# Altium project ELC102 - Scoreboard.PrjPcb (part 2 of 3)

## Sheet ELC102 - Old Circuits.SchDoc: ELC102 - NEOS Scoreboard
size C
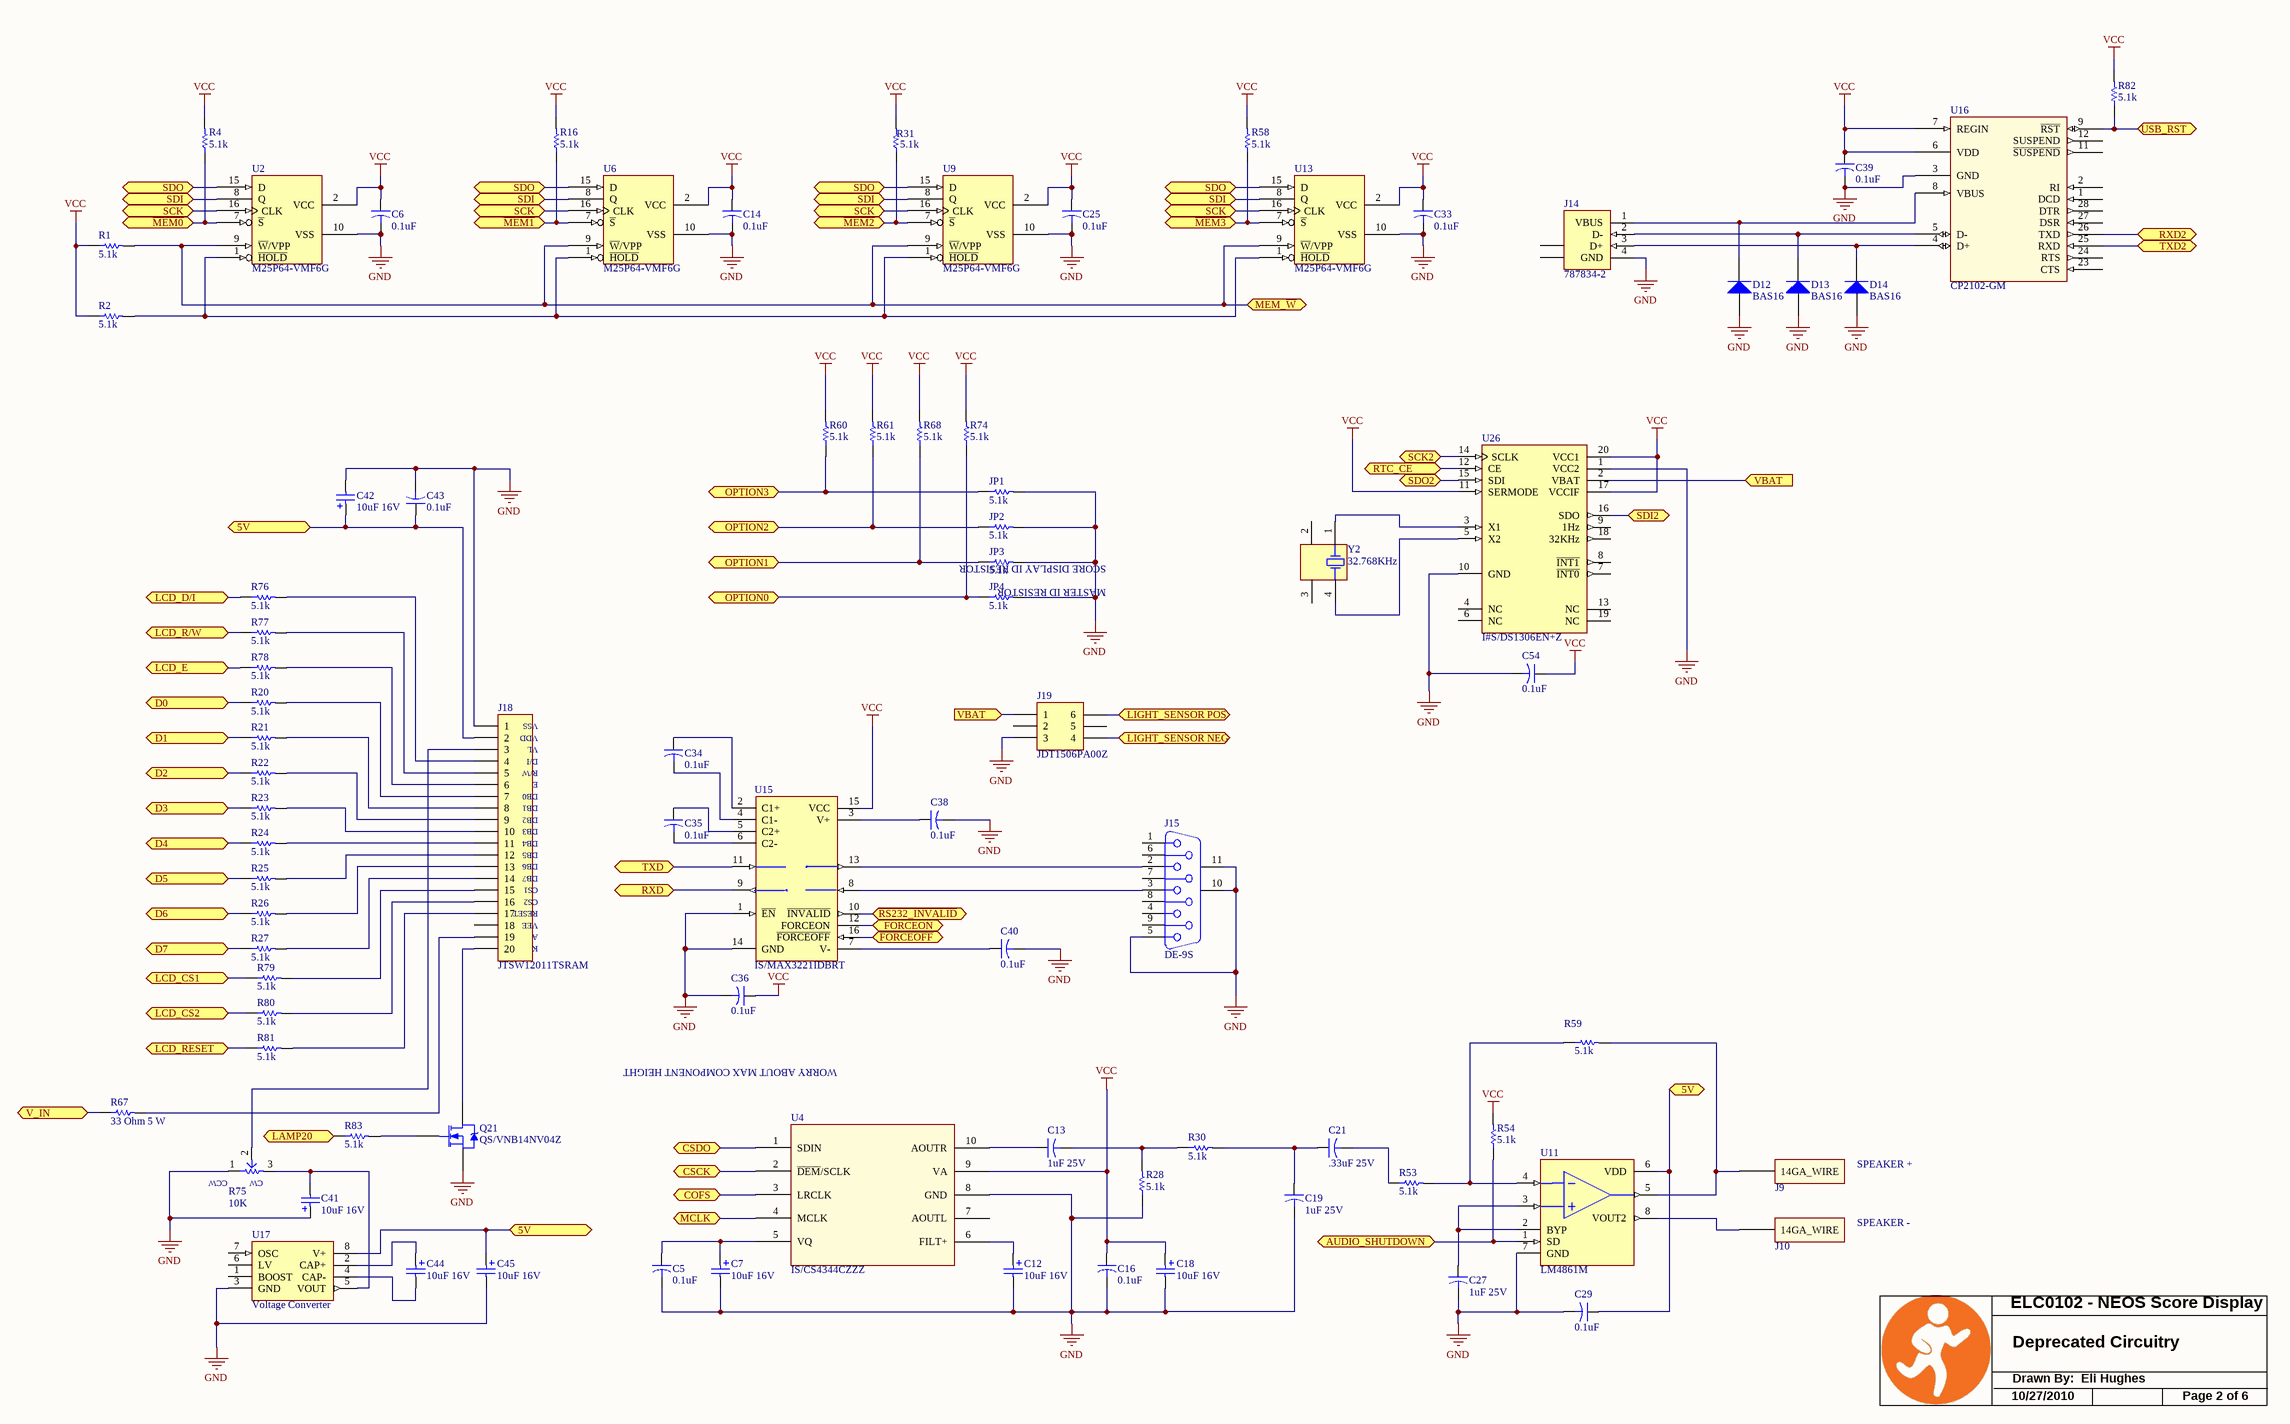
[diagram p3: ELC102 - Old Circuits.SchDoc]

### Parts
C5  0.1uF  [C0805]
C6  0.1uF  [C0805]
C7  10uF 16V  [C4X5.8]
C12  10uF 16V  [C4X5.8]
C13  1uF 25V  [R1206]
C14  0.1uF  [C0805]
C16  0.1uF  [C0805]
C18  10uF 16V  [C4X5.8]
C19  1uF 25V  [R1206]
C21  .33uF 25V  [R1206]
C25  0.1uF  [C0805]
C27  1uF 25V  [R1206]
C29  0.1uF  [C0805]
C33  0.1uF  [C0805]
C34  0.1uF  [C0805]
C35  0.1uF  [C0805]
C36  0.1uF  [C0805]
C38  0.1uF  [C0805]
C39  0.1uF  [C0805]
C40  0.1uF  [C0805]
C41  10uF 16V  [C4X5.8]
C42  10uF 16V  [C4X5.8]
C43  0.1uF  [C0805]
C44  10uF 16V  [C4X5.8]
C45  10uF 16V  [C4X5.8]
C54  0.1uF  [C0805]
D12  BAS16  [SOT23]  (no BOM)
D13  BAS16  [SOT23]  (no BOM)
D14  BAS16  [SOT23]  (no BOM)
J9  ~14GA_WIRE  [WIRE_14GA]  (value not drawn)  (no BOM)
J10  ~14GA_WIRE  [WIRE_14GA]  (value not drawn)  (no BOM)
J14  787834-2  [KUSBVX-BS1N]  (no BOM)
J15  DE-9S  [DSUBV9]  (no BOM)
J18  JTSW12011TSRAM  [JTSW12011TSRAM]
J19  JDT1506PA00Z  [JDT1506PA00Z - 2 holes]
JP1  5.1k  [R0805]
JP2  5.1k  [R0805]
JP3  5.1k  [R0805]
JP4  5.1k  [R0805]
Q21  QS/VNB14NV04Z  [D2PAK]
R1  5.1k  [R0805]
R2  5.1k  [R0805]
R4  5.1k  [R0805]
R16  5.1k  [R0805]
R20  5.1k  [R0805]
R21  5.1k  [R0805]
R22  5.1k  [R0805]
R23  5.1k  [R0805]
R24  5.1k  [R0805]
R25  5.1k  [R0805]
R26  5.1k  [R0805]
R27  5.1k  [R0805]
R28  5.1k  [R0805]
R30  5.1k  [R0805]
R31  5.1k  [R0805]
R53  5.1k  [R0805]
R54  5.1k  [R0805]
R58  5.1k  [R0805]
R59  5.1k  [R0805]
R60  5.1k  [R0805]
R61  5.1k  [R0805]
R67  33 Ohm 5 W  [RES30.6-25.5X9]
R68  5.1k  [R0805]
R74  5.1k  [R0805]
R75  10K  [P3299W]
R76  5.1k  [R0805]
R77  5.1k  [R0805]
R78  5.1k  [R0805]
R79  5.1k  [R0805]
R80  5.1k  [R0805]
R81  5.1k  [R0805]
R82  5.1k  [R0805]
R83  5.1k  [R0805]
U2  M25P64-VMF6G  [so16w]  (no BOM)
U4  IS/CS4344CZZZ  [TSSOP\10]
U6  M25P64-VMF6G  [so16w]  (no BOM)
U9  M25P64-VMF6G  [so16w]  (no BOM)
U11  LM4861M  [soic 8]
U13  M25P64-VMF6G  [so16w]  (no BOM)
U15  IS/MAX3221IDBRT  [SSOP16]  (no BOM)
U16  CP2102-GM  [QFN28]  (no BOM)
U17  Voltage Converter  [SOIC 8]
U26  I#S/DS1306EN+Z  [TSSOP-20]
Y2  32.768KHz  [ZS/MC306]

### Ports
5V, AUDIO_SHUTDOWN, COFS, CSCK, CSDO, D0, D1, D2, D3, D4, D5, D6, D7, FORCEON, LAMP20, LCD_CS1, LCD_CS2, LCD_D/I, LCD_E, LCD_R/W, LCD_RESET, LIGHT_SENSOR NEG, LIGHT_SENSOR POS, MCLK, MEM_~{W}, OPTION0, OPTION1, OPTION2, OPTION3, RTC_CE, RXD, RXD2, SCK, SCK2, SDI, SDI2, SDO, SDO2, TXD, TXD2, USB_RST, V_IN, VBAT (in), ~{FORCEOFF}, ~{MEM0}, ~{MEM1}, ~{MEM2}, ~{MEM3}, ~{RS232_INVALID}

### Nets
+5 VDC: C29.1 C42.1 C43.1 C45.1 J18.2 U11.6(VDD) U17.8(V+) ; port 5V
GND: C5.2 C6.2 C7.2 C12.2 C14.2 C16.2 C18.2 C19.2 C25.2 C27.2 C29.2 C33.2 C36.2 C38.2 C39.2 C40.2 C41.1 C42.2 C43.2 C45.2 C54.2 D12.1(A) D13.1(A) D14.1(A) J14.4(GND) J15.5 J15.10(MH1) J15.11(MH2) J18.1 J19.3 JP1.2 JP2.2 JP3.2 JP4.2 Q21.3(S) R28.1 R75.1(CCW) U2.10(VSS) U4.8(GND) U6.10(VSS) U9.10(VSS) U11.7(GND) U13.10(VSS) U15.1(~{EN}) U15.14(GND) U16.3(GND) U17.3(GND) U26.1(VCC2) U26.10(GND)
VCC: C6.1 C14.1 C16.1 C18.1 C25.1 C33.1 C36.1 C39.1 C54.1 R1.1 R2.1 R4.2 R16.2 R31.2 R54.2 R58.2 R60.2 R61.2 R68.2 R74.2 R82.2 U2.2(VCC) U4.9(VA) U6.2(VCC) U9.2(VCC) U13.2(VCC) U15.15(VCC) U16.6(VDD) U16.7(REGIN) U26.11(SERMODE) U26.17(VCCIF) U26.20(VCC1)  [project net +3.3 VDC]
Vin: R67.1 ; port V_IN
AUDIO_SHUTDOWN: R54.1 U11.1(SD) ; port AUDIO_SHUTDOWN
COFS: U4.3(LRCLK) ; port COFS
CSCK: U4.2(~{DEM}/SCLK) ; port CSCK
CSDO: U4.1(SDIN) ; port CSDO
D0: R20.1 ; port D0
D1: R21.1 ; port D1
D2: R22.1 ; port D2
D3: R23.1 ; port D3
D4: R24.1 ; port D4
D5: R25.1 ; port D5
D6: R26.1 ; port D6
D7: R27.1 ; port D7
~{FORCEOFF}: U15.16(~{FORCEOFF}) ; port ~{FORCEOFF}
FORCEON: U15.12(FORCEON) ; port FORCEON
LAMP20: R83.1 ; port LAMP20
LCD_CS1: R79.1 ; port LCD_CS1
LCD_CS2: R80.1 ; port LCD_CS2
LCD_D/I: R76.1 ; port LCD_D/I
LCD_E: R78.1 ; port LCD_E
LCD_R/W: R77.1 ; port LCD_R/W
LCD_RESET: R81.1 ; port LCD_RESET
LIGHT_SENSOR NEG: J19.4 ; port LIGHT_SENSOR NEG
LIGHT_SENSOR POS: J19.6 ; port LIGHT_SENSOR POS
MCLK: U4.4(MCLK) ; port MCLK
MEM0: R4.1 U2.7(~{S}) ; port ~{MEM0}
MEM1: R16.1 U6.7(~{S}) ; port ~{MEM1}
MEM2: R31.1 U9.7(~{S}) ; port ~{MEM2}
MEM3: R58.1 U13.7(~{S}) ; port ~{MEM3}
MEM_SCK: U2.16(CLK) U6.16(CLK) U9.16(CLK) U13.16(CLK) ; port SCK
MEM_SDI: U2.8(Q) U6.8(Q) U9.8(Q) U13.8(Q) ; port SDI
MEM_SDO: U2.15(D) U6.15(D) U9.15(D) U13.15(D) ; port SDO
MEM_~{W}: R1.2 U2.9(~{W}/VPP) U6.9(~{W}/VPP) U9.9(~{W}/VPP) U13.9(~{W}/VPP) ; port MEM_~{W}
OPT0: JP4.1 R74.1 ; port OPTION0
OPT1: JP3.1 R68.1 ; port OPTION1
OPT2: JP2.1 R61.1 ; port OPTION2
OPT3: JP1.1 R60.1 ; port OPTION3
~{RS232_INVALID}: U15.10(~{INVALID}) ; port ~{RS232_INVALID}
RTC_CE: U26.12(CE) ; port RTC_CE
RTC_SCK: U26.14(SCLK) ; port SCK2
RTC_SDI: U26.16(SDO) ; port SDI2
RTC_SDO: U26.15(SDI) ; port SDO2
RXD_RS232: U15.9(R1OUT) ; port RXD
RXD_USB: U16.26(TXD) ; port RXD2
TXD_RS233: U15.11(T1IN) ; port TXD
TXD_USB: U16.25(RXD) ; port TXD2
USB_RST: R82.1 U16.9(~{RST}) ; port USB_RST
VBAT: J19.1 U26.2(VBAT) ; port VBAT
NetC5_1: C5.1 C7.1 U4.5(VQ)
NetC12_1: C12.1 U4.6(FILT+)
NetC13_1: C13.1 U4.10(AOUTR)
NetC13_2: C13.2 R28.2 R30.1
NetC19_1: C19.1 C21.1 R30.2
NetC21_2: C21.2 R53.1
NetC27_1: C27.1 U11.2(BYP) U11.3(IN+)
NetC34_1: C34.1 U15.2(C1+)
NetC34_2: C34.2 U15.4(C1-)
NetC35_1: C35.1 U15.5(C2+)
NetC35_2: C35.2 U15.6(C2-)
NetC38_1: C38.1 U15.3(V+)
NetC40_1: C40.1 U15.7(V-)
NetC41_2: C41.2 R75.3(CW) U17.5(VOUT)
NetC44_1: C44.1 U17.2(CAP+)
NetC44_2: C44.2 U17.4(CAP-)
NetD12_3: D12.3(K) J14.1(VBUS) U16.8(VBUS)
NetD13_3: D13.3(K) J14.2(D-) U16.5(D-)
NetD14_3: D14.3(K) J14.3(D+) U16.4(D+)
NetJ9_1: J9.1(14GA_WIRE) R59.2 U11.5(VOUT1)
NetJ10_1: J10.1(14GA_WIRE) U11.8(VOUT2)
NetJ15_2: J15.2 U15.13(T1OUT)
NetJ15_3: J15.3 U15.8(R1IN)
NetJ18_3: J18.3 R75.2(T)
NetJ18_4: J18.4 R76.2
NetJ18_5: J18.5 R77.2
NetJ18_6: J18.6 R78.2
NetJ18_7: J18.7 R20.2
NetJ18_8: J18.8 R21.2
NetJ18_9: J18.9 R22.2
NetJ18_10: J18.10 R23.2
NetJ18_11: J18.11 R24.2
NetJ18_12: J18.12 R25.2
NetJ18_13: J18.13 R26.2
NetJ18_14: J18.14 R27.2
NetJ18_15: J18.15 R79.2
NetJ18_16: J18.16 R80.2
NetJ18_17: J18.17 R81.2
NetJ18_19: J18.19 R67.2
NetJ18_20: J18.20 Q21.2(D)
NetQ21_1: Q21.1(G) R83.2
NetR2_2: R2.2 U2.1(~{HOLD}) U6.1(~{HOLD}) U9.1(~{HOLD}) U13.1(~{HOLD})
NetR53_2: R53.2 R59.1 U11.4(IN-)
NetU26_3: U26.3(X1) Y2.1(OSC1)
NetU26_5: U26.5(X2) Y2.4(OSC2)

Not connected (* = marked no-connect by the designer): J14 5(SHLD) 6(SHLD); J15 1 4 6 7 8 9; J18 18; J19 2 5; U4 7(AOUTL); U16 1(DCD) 2(RI) 11(~{SUSPEND}) 12(SUSPEND) 23(CTS) 24(RTS) 27(DSR) 28(DTR); U17 1(BOOST) 6(LV) 7(OSC); U26 4(NC) 6(NC) 7(~{INT0}) 8(~{INT1}) 9(1Hz) 13(NC) 18(32KHz) 19(NC); Y2 2(COM) 3(COM)

### Notes on the sheet
- MASTER ID RESISTOR
- SCORE DISPLAY ID RESISTOR
- (near J18) VSS
- (near J18) VDD
- (near J18) VL
- (near J18) R/W
- (near J18) D/I
- (near J18) E
- (near J18) DB0
- (near J18) DB1
- (near J18) DB2
- (near J18) DB3
- (near J18) DB4
- (near J18) DB5
- (near J18) DB6
- (near J18) DB7
- (near J18) CS1
- (near J18) CS2
- (near J18) RESET
- (near J18) VEE
- (near J18) A
- (near J18) K
- WORRY ABOUT MAX COMPONENT HEIGHT
- SPEAKER +
- SPEAKER -
- ELC0102 - NEOS Score Display
- Deprecated Circuitry
- 10/27/2010
- Drawn By:  Eli Hughes
- Page 2 of 6

### Library data of the parts
C5 C6 C14 C16 C25 C29 C33-C36 C38-C40 C43 C54 = CS/C0805C104K5RACK: CAP .10UF 50V CERAMIC X7R 0805; Manufacturer: Kemet; Manufacturer Part Number: C0805C104K5RACTU; Source Part Number: 399-1170-2-ND; Capacitance: 0.1µF; Tolerance: ±10%; ROHS Certificate: Lead free / RoHS compliant; Source: Digikey; Value: 0.1uF; Supplier 1: Digi-Key; RoHS: RoHS Compliant; Category: Capacitors; Stock 1: 10120790; Pricing 1: 10=0.105, 100=0.0378, 250=0.02732, 500=0.02016, 1000=0.01365 (USD); Voltage - Rated: 50V; Temperature Coefficient: X7R; Mounting Type: Surface Mount, MLCC; Operating Temperature: -55°C ~ 125°C; Features: -; Applications: General Purpose; Ratings: -; Package / Case: 0805 (2012 Metric); Size / Dimension: 0.079" L x 0.049" W (2.00mm x 1.25mm); Lead Spacing: -; Thickness: 0.90mm; Packaging: Cut Tape (CT); Lead Style: -; ComponentLink1URL: http://www.kemet.com/datasheets&C0805C104K5RACTU; ComponentLink1Description: http://www.kemet.com/datasheets&C0805C104K5RACTU; Supplier Part Number 1: 399-1170-1-ND
C7 C12 C18 C41 C42 C44 C45 = CS/EEVFK1C100RP: Panasonic 10uF 16V SMT; Manufacturer: Panasonic - ECG; Manufacturer Part Number: EEE-FK1C100R; Source Part Number: PCE3782TR-ND; Value: EEE-FK1C100R; Description: CAP ELECT 10UF 16V FK SMD; Capacitance: 10µF; Tolerance: ±20%; Lifetime @ Temp.: 2000 Hrs @ 105°C; Ripple Current: 90mA; Impedance: 1.35 Ohm; Surface Mount Land Size: 0.169" L x 0.169" W (4.30mm x 4.30mm); ROHS Certificate: Lead free / RoHS compliant; Source: Digikey; Supplier 1: Digi-Key; RoHS: RoHS Compliant; Category: Capacitors; Stock 1: 412703; Pricing 1: 1=0.54, 50=0.309, 100=0.2575, 250=0.19312, 500=0.1648, 1000=0.12875 (USD); Voltage Rating: 16V; Operating Temperature: -55°C ~ 105°C; Features: General Purpose; ESR (Equivalent Series Resistance): -; Mounting Type: Surface Mount; Package / Case: Radial, Can - SMD; Size / Dimension: 0.157" Dia (4.00mm); Height: 0.228" (5.80mm); Lead Spacing: -; Packaging: Cut Tape (CT); ComponentLink1URL: http://industrial.panasonic.com/www-cgi/jvcr13pz.cgi?E+PZ+3+ABA0120+EEEFK1C100R+7+WW; ComponentLink1Description: http://industrial.panasonic.com/www-cgi/jvcr13pz.cgi?E+PZ+3+ABA0120+EEEFK1C100R+7+WW; Supplier Part Number 1: PCE3782CT-ND
C13 C19 C27 = CS/ECJ3YB1E105KP: 1uF 25V 1206 Panasonic; Manufacturer: Panasonic - ECG; Manufacturer Part Number: ECJ-3YB1E105K; Description: CAP 1UF 25V CERAMIC X7R 1206; Capacitance: 1.0µF; Tolerance: ±10%; Temperature Coefficient: X7R; Published: 23-Sep-2002; Publisher: Altium Limited; Supplier 1: Digi-Key; RoHS: RoHS Compliant; Category: Capacitors; Stock 1: 0; Voltage - Rated: 25V; Mounting Type: Surface Mount, MLCC; Operating Temperature: -55°C ~ 125°C; Features: Low ESR; Applications: General Purpose; Ratings: -; Package / Case: 1206 (3216 Metric); Size / Dimension: 0.126" L x 0.063" W (3.20mm x 1.60mm); Lead Spacing: -; Thickness: 1.60mm; Packaging: Cut Tape (CT); Lead Style: -; ComponentLink1URL: http://media.digikey.com/pdf/Data%20Sheets/Panasonic%20Capacitors%20PDFs/ECJ(HighCapacitance).pdf; ComponentLink1Description: http://media.digikey.com/pdf/Data%20Sheets/Panasonic%20Capacitors%20PDFs/ECJ(HighCapacitance).pdf; Supplier Part Number 1: PCC1893CT-ND
C21 = CS/ECJ3VB1E334KP: .33uF 25V 1206 Panasonic; Manufacturer: Panasonic - ECG; Manufacturer Part Number: ECJ-3VB1E334K; Description: CAP .33UF 25V CERAMIC X7R 1206; Capacitance: 0.33µF; Tolerance: ±10%; Temperature Coefficient: X7R; Published: 23-Sep-2002; Publisher: Altium Limited; Supplier 1: Digi-Key; RoHS: RoHS Compliant; Category: Capacitors; Stock 1: 0; Voltage - Rated: 25V; Mounting Type: Surface Mount, MLCC; Operating Temperature: -55°C ~ 125°C; Features: Low ESR; Applications: General Purpose; Ratings: -; Package / Case: 1206 (3216 Metric); Size / Dimension: 0.126" L x 0.063" W (3.20mm x 1.60mm); Lead Spacing: -; Thickness: 0.85mm; Packaging: Cut Tape (CT); Lead Style: -; ComponentLink1URL: http://industrial.panasonic.com/www-cgi/jvcr13pz.cgi?E+PZ+3+ABJ0001+ECJ3VB1E334K+7+WW; ComponentLink1Description: http://industrial.panasonic.com/www-cgi/jvcr13pz.cgi?E+PZ+3+ABJ0001+ECJ3VB1E334K+7+WW; Supplier Part Number 1: PCC1889CT-ND
D12-D14 = DS/BAS16000Z: Zetex BAS16 Diode; Manufacturer: Diodes Inc; Manufacturer Part Number: BAS16-7-F; Note: Pin 2 is not connected and not drawn.; Description: DIODE SWITCH 75V 350MW SOT23-3; Voltage - Forward (Vf) (Max) @ If: 1.25V @ 150mA; Voltage - DC Reverse (Vr) (Max): 75V; Current - Average Rectified (Io): 200mA; Current - Reverse Leakage @ Vr: 1µA @ 75V; Diode Type: Standard; Speed: Small Signal =< 200mA (Io), Any Speed; Reverse Recovery Time (trr): 4ns; Capacitance @ Vr, F: 2pF @ 0V, 1MHz; Published: 21-Mar-2003; DatasheetDocument: Oct-1999; PackageDocument: Sep-2001; PackageReference: SOT-23; Publisher: Altium Limited; ComponentLink1Description: Manufacturer Link; ComponentLink1URL: http://www.infineon.com/; Supplier 1: Digi-Key; RoHS: RoHS Compliant; Category: Discrete Semiconductor Products; Stock 1: 856038; Pricing 1: 1=0.3, 10=0.198, 100=0.086, 250=0.05592, 500=0.03956, 1000=0.02795 (USD); Mounting Type: Surface Mount; Package / Case: SOT-23-3, TO-236-3, Micro3™, SSD3, SST3; Packaging: Cut Tape (CT); Supplier Device Package: *; ComponentLink2URL: http://www.diodes.com/datasheets/ds12003.pdf; ComponentLink2Description: http://www.diodes.com/datasheets/ds12003.pdf; Supplier Part Number 1: BAS16-FDICT-ND
J14 = 787834-2: USB 1.1, Vertical, Thru-Hole, B Type, Receptacle, 4 Position, Natural; Manufacturer: Tyco Electronics; Manufacturer Part Number: 5787834-2; ContactMaterial: Copper Alloy; ContactPlating: Gold Flash over Palladium Nickel or Gold (30) over Nickel; TerminationLength: 3.02mm [0.119in.]; PCB_Layout: Complies with manufacturer's recommendation.; DrillSize: Corresponds to nominal value.; PanelGround: Without; Description: CONN RCPT USB TYPE B PCB VERT; Connector Type: USB - B; Number of Contacts: 4; Specifications: USB 2.0; Published: 15-Jul-2004; DatasheetDocument: 11-Jan-2004; PackageDocument: 11-Jan-2004; PackageReference: 787834; Publisher: Altium Limited; HousingMaterial: Thermoplastic; ComponentLink1Description: Manufacturer Link; ComponentLink1URL: http://www.tycoelectronics.com/; ComponentLink2Description: Packaging Specification; ComponentLink2URL: http://ecommas.tycoelectronics.com/commerce/DocumentDelivery/DDEController?Action=showdoc&DocId=Customer+Drawing%7F787834%7FG%7Ftif%7FEnglish%7FC_787834_G.tif; Supplier 1: Digi-Key; RoHS: RoHS Compliant; Category: Connectors, Interconnects; Stock 1: 0; Pricing 1: 1008=1.37655 (USD); Gender: Receptacle; Mounting Type: Through Hole, Vertical; Features: Board Lock; Packaging: Tray; ComponentLink3URL: http://documents.tycoelectronics.com/commerce/DocumentDelivery/DDEController?Action=srchrtrv&DocNm=5787834&DocType=CD&DocLang=EN; ComponentLink3Description: http://documents.tycoelectronics.com/commerce/DocumentDelivery/DDEController?Action=srchrtrv&DocNm=5787834&DocType=CD&DocLang=EN; Supplier Part Number 1: 5787834-2-ND
J15 = JK85ED9SBR0Z: D-Sub 9S Kycon Straight W/retainers; PackageDocument: O; Positions: 9; Gender: Receptacle; Published: 15-Jun-2001; LatestRevisionDate: 17-Jul-2002; LatestRevisionNote: Re-released for DXP Platform.; DatasheetDocument: 1-Sep-1999; PackageReference: 788750; Publisher: Altium Limited; Orientation: Right Angle
J18 = JTSW12011TSRAM: Samtec Header RA 20P Stood off board; LatestRevisionDate: 17-Jul-2002; LatestRevisionNote: Re-released for DXP Platform.; Publisher: Altium Limited
J19 = JDT1506PA00Z: Deutsch 6P Sealed PCB connector; Supplier 1: *; Supplier Part Number 1: *
JP1-JP4 R1 R2 R4 R16 R20-R28 R30 R31 R53 R54 R58-R61 R68 R74 R76-R83 = ERJ-6ENF5101V: RES 5.10K OHM 1/8W 1% 0805 SMD; Manufacturer: Panasonic - ECG; Power (Watts): 0.125W, 1/8W; Temperature Coefficient: ±100ppm/°C; ComponentLink1Description: http://industrial.panasonic.com/www-cgi/jvcr13pz.cgi?E+PZ+3+AOA0002+ERJ6ENF5101V+7+WW; ComponentLink1URL: http://industrial.panasonic.com/www-cgi/jvcr13pz.cgi?E+PZ+3+AOA0002+ERJ6ENF5101V+7+WW; Value: 5.1k; Supplier 1: Digi-Key; Manufacturer Part Number: ERJ-6ENF5101V; RoHS: RoHS Compliant; Category: Resistors; Stock 1: 32293; Pricing 1: 1=0.07, 50=0.0276, 100=0.021, 250=0.0156, 500=0.01152, 1000=0.00768 (USD); Resistance In Ohms: 5.10K; Composition: Thick Film; Features: -; Tolerance: ±1%; Case: 0805 (2012 metric); Size / Dimension: 0.079" L x 0.049" W (2.00mm x 1.25mm); Height: 0.024" (0.60mm); Lead Style: Surface Mount (SMD - SMT); Packaging: Digi-Reel®; Supplier Part Number 1: P5.10KCDKR-ND
Q21 = QS/VNB14NV04Z: HEXFET Power MOSFET; Manufacturer: STMicroelectronics; Source Part Number: VNB14NV04-ND; Description: MOSFET POWER 40V 12A D2PAK; Type: Low Side; Input Type: Non-Inverting; Number of Outputs: 1; On-State Resistance: 35 mOhm; Current - Peak Output: 18A; Manufacturer Part Number: VNB14NV04; ROHS Certificate: Lead free / RoHS compliant; Source: Digikey; Value: VNB14NV04; Supplier 1: Digi-Key; RoHS: RoHS Compliant; Category: Integrated Circuits (ICs); Stock 1: 0; Pricing 1: 800=1.5495 (USD); Current - Output / Channel: -; Voltage - Supply: -; Operating Temperature: -; Mounting Type: Surface Mount; Package / Case: TO-263-2, D²Pak (2 leads + Tab), TO-263AB; Packaging: Tube; Supplier Device Package: *; ComponentLink1URL: http://www.st.com/stonline/products/literature/ds/1643/vnb14n04.pdf; ComponentLink1Description: http://www.st.com/stonline/products/literature/ds/1643/vnb14n04.pdf; Supplier Part Number 1: VNB14NV04-ND
R67 = RES 5W: Resistor 5W square ceramic; Published: 8-Jun-2000; LatestRevisionDate: 17-Jul-2002; LatestRevisionNote: Re-released for DXP Platform.; Publisher: Altium Limited
R75 = P3299W11030B: Bourns Trim Pot 10K Vertical; Published: 8-Jun-2000; LatestRevisionDate: 17-Jul-2002; LatestRevisionNote: Re-released for DXP Platform.; PackageReference: AXIAL-0.3; Publisher: Altium Limited
U2 U6 U9 U13 = IS/M25P64VMF6GZ: ST Serial memory 64MBit SOIC-16; Manufacturer: NUMONYX; Manufacturer Part Number: M25P64-VMF6P; Description: NUMONYX - M25P64-VMF6P - IC, FLASH, 64MBIT, 75MHZ, SOIC-16; Memory Size: 64; Interface: SPI; Memory Configuration: 8M x 8; Clock Frequency: 75; Supply Voltage Range: 2.7V to 3.6; Memory Case Style: SOIC; No. of Pins: 16; Supplier 1: Newark; Category: Semiconductors - ICs; Stock 1: 1514; Pricing 1: 1=10.48, 10=10.2, 100=9.39, 250=8.13, 500=7.5 (USD); ComponentLink1URL: http://www.numonyx.com/Documents/Datasheets/M25P64.pdf; ComponentLink1Description: http://www.numonyx.com/Documents/Datasheets/M25P64.pdf; Supplier Part Number 1: 37M4673
U4 = IS/CS4344CZZZ: Cirrus 24 bit DAC; Manufacturer: Cirrus Logic Inc; Manufacturer Part Number: CS4344-CZZR; Description: IC DAC 24BIT 192KHZ 10-TSSOP; Number of Bits: 24; Data Interface: Serial; Number of Converters: 2; Voltage Supply Source: Single Supply; Power Dissipation (Max): 150mW; Supplier 1: Digi-Key; RoHS: RoHS Compliant; Category: Integrated Circuits (ICs); Stock 1: 0; Pricing 1: 2000=1.4364 (USD); Settling Time: -; Operating Temperature: -10°C ~ 70°C; Mounting Type: Surface Mount; Package / Case: 10-TSSOP; Packaging: Tube; Supplier Device Package: *; Supplier Part Number 1: CS4344-CZZR-ND
U11 = LM4861M: 1.1 Audio Power Amplifier with Shutdown Mode; Manufacturer: National Semiconductor; Manufacturer Part Number: LM4861MX; Description: IC AMP AUDIO PWR 1.5W MONO 8SOIC; Output Type: 1-Channel (Mono); Max Output Power x Channels @ Load: 1.5W x 1 @ 8 Ohm; Voltage - Supply: 2 V ~ 5.5 V; Published: 15-Apr-2002; LatestRevisionDate: 06-Jun-2005; LatestRevisionNote: Stylized 3D Model Added.; DatasheetDocument: May-1997; PackageDocument: Sep-1997; PackageReference: M08A; Publisher: Altium Limited; Code_JEDEC: MS-012-AA; Code_IPC: SO8; ComponentLink1Description: Manufacturer Link; ComponentLink1URL: http://www.national.com/; ComponentLink2Description: Datasheet; ComponentLink2URL: http://www.national.com/ds.cgi/LM/LM4861.pdf; ComponentLink3Description: URL Link1; ComponentLink3URL: http://www.national.com/pf/LM/LM4861.html; Supplier 1: Digi-Key; RoHS: RoHS Compliant; Category: Integrated Circuits (ICs); Stock 1: 9270; Pricing 1: 1=1.93, 25=1.4852, 100=1.3475, 250=1.21, 500=1.045, 1000=0.88 (USD); Type: Class AB; Features: Shutdown, Thermal Protection; Mounting Type: Surface Mount; Package / Case: 8-SOIC (0.154", 3.90mm Width); Packaging: Cut Tape (CT); Supplier Device Package: *; ComponentLink4URL: http://www.national.com/ds/LM/LM4861.pdf; ComponentLink4Description: http://www.national.com/ds/LM/LM4861.pdf; Supplier Part Number 1: LM4861MXCT-ND
U15 = IS/MAX3221IDBRT: TI 3.3V RS-232 chip 16-SSOP; Manufacturer: Texas Instruments; PackageDocument: 1996; Description: IC DRVR/RCVR RS-232 1-CH 16-SSOP; Number of Drivers/Receivers: 1/1; Protocol: RS232; Voltage - Supply: 3 V ~ 5.5 V; Published: 16-Jan-2001; LatestRevisionDate: 6-Jun-2005; LatestRevisionNote: Stylized 3D Model Added.; DatasheetDocument: Jan-1998; PackageReference: SSOP16; Publisher: Altium Limited; ComponentLink1Description: Manufacturer Link; ComponentLink1URL: http://www.maxim-ic.com/; ComponentLink2Description: Datasheet; ComponentLink2URL: http://pdfserv.maxim-ic.com/en/ds/MAX3221E-MAX3243E.pdf; Supplier 1: Digi-Key; Manufacturer Part Number: MAX3221IDBR; RoHS: RoHS Compliant; Category: Integrated Circuits (ICs); Stock 1: 35498; Pricing 1: 1=2.28, 25=1.7552, 100=1.5925, 250=1.43, 500=1.235, 1000=1.04 (USD); Type: Transceiver; Mounting Type: Surface Mount; Package / Case: 16-SSOP; Packaging: Cut Tape (CT); Supplier Device Package: *; ComponentLink3URL: http://focus.ti.com/lit/ds/symlink/max3221.pdf; ComponentLink3Description: http://focus.ti.com/lit/ds/symlink/max3221.pdf; Supplier Part Number 1: 296-9595-1-ND
U16 = IS/CP2102GMZ: Silicon Labs USB to UART bridge QFN-28; Manufacturer: Silicon Laboratories  Inc; Description: IC USB-TO-UART BRIDGE 28VQFN; Voltage - Supply: 3 V ~ 3.6 V; Supplier 1: Digi-Key; Manufacturer Part Number: CP2102-GM; RoHS: RoHS Compliant; Category: Integrated Circuits (ICs); Stock 1: 51554; Pricing 1: 1=3.01, 25=2.832, 100=2.655, 1000=2.5488 (USD); Applications: USB; Interface: UART; Package / Case: 28-VQFN Exposed Pad, 28-HVQFN, 28-SQFN, 28-DHVQFN; Packaging: Tube; Mounting Type: Surface Mount; Supplier Device Package: *; ComponentLink1URL: https://www.silabs.com/Support%20Documents/TechnicalDocs/cp2102.pdf; ComponentLink1Description: https://www.silabs.com/Support%20Documents/TechnicalDocs/cp2102.pdf; Supplier Part Number 1: 336-1160-ND
U17 = IS/ICL7660ACBA: Switched Capacitor Voltage Converter; Manufacturer: Intersil; Manufacturer Part Number: ICL7660ACBAZA-T; Description: IC VOLTAGE CONVERTER CMOS 8-SOIC; Internal Switch(s): Yes; Synchronous Rectifier: No; Number of Outputs: 1; Frequency - Switching: 10kHz; Voltage - Input: 1.5 ~ 12 V; Published: 15-Apr-2002; LatestRevisionDate: 06-Jun-2005; LatestRevisionNote: Stylized 3D Model Added.; DatasheetDocument: Apr-1997; PackageDocument: Sep-1997; PackageReference: M08A; Publisher: Altium Limited; Code_JEDEC: MS-012-AA; Code_IPC: SO8; ComponentLink1Description: Manufacturer Link; ComponentLink1URL: http://www.national.com/; ComponentLink2Description: Datasheet; ComponentLink2URL: http://www.national.com/ds.cgi/LM/LMC7660.pdf; ComponentLink3Description: URL Link1; ComponentLink3URL: http://www.national.com/pf/LM/LMC7660.html; Supplier 1: Digi-Key; RoHS: RoHS Compliant; Category: Integrated Circuits (ICs); Stock 1: 6618; Pricing 1: 1=1.76, 25=0.98, 100=0.784 (USD); Type: Switched Capacitor (Charge Pump), Inverting; Voltage - Output: -; Current - Output: -; Power - Output: -; Operating Temperature: 0°C ~ 70°C; Mounting Type: Surface Mount; Package / Case: 8-SOIC (0.154", 3.90mm Width); Packaging: Cut Tape (CT); Supplier Device Package: *; ComponentLink4URL: http://www.intersil.com/data/fn/fn3072.pdf; ComponentLink4Description: http://www.intersil.com/data/fn/fn3072.pdf; Supplier Part Number 1: ICL7660ACBAZA-TCT-ND
U26 = I#S/DS1306EN+Z: Serial Alarm Real-Time Clock; Manufacturer: Maxim Integrated Products; PackageDocument: 1999; Description: IC RTC SERIAL ALARM IND 20-TSSOP; Memory Size: 96B; Time Format: HH:MM:SS (12/24 hr); Date Format: YY-MM-DD-dd; Interface: SPI, 3-Wire Serial; Voltage - Supply: 2 V ~ 5.5 V; Published: 13-Oct-2000; LatestRevisionDate: 06-Jun-2005; LatestRevisionNote: Stylized 3D Model Added.; DatasheetDocument: 20-Aug-1999; PackageReference: DIP16; Publisher: Altium Limited; ComponentLink1Description: Manufacturer Link; ComponentLink1URL: http://www.maxim-ic.com/; ComponentLink2Description: Datasheet; ComponentLink2URL: http://pdfserv.maxim-ic.com/en/ds/DS1306.pdf; ComponentLink3Description: Discontinuation Notice; ComponentLink3URL: http://www.maxim-ic.com/qa/pdfs/non-obsolescence-letter.pdf; Supplier 1: Digi-Key; Manufacturer Part Number: DS1306EN+; RoHS: RoHS Compliant; Category: Integrated Circuits (ICs); Stock 1: 17260; Pricing 1: 1=6.33, 25=4.22, 100=3.06, 500=2.6375 (USD); Type: Clock/Calendar/Alarm; Operating Temperature: -40°C ~ 85°C; Mounting Type: Surface Mount; Package / Case: 20-TSSOP; Packaging: Tube; Supplier Device Package: *; ComponentLink4URL: http://datasheets.maxim-ic.com/en/ds/DS1306.pdf; ComponentLink4Description: http://datasheets.maxim-ic.com/en/ds/DS1306.pdf; Supplier Part Number 1: DS1306EN+-ND
Y2 = ZS/MC30632.768KE3Z: Epson MC-306 32.768K-E3; Published: 17-Jul-2002; DatasheetDocument: 18-Apr-2000; PackageReference: ECX-3M; Publisher: Altium Limited; ComponentLink1Description: Manufacturer Link; ComponentLink1URL: http://www.ecsxtal.com/

## Sheet ELC102 - Green Digits.SchDoc: ELC102 - NEOS Scoreboard
size C
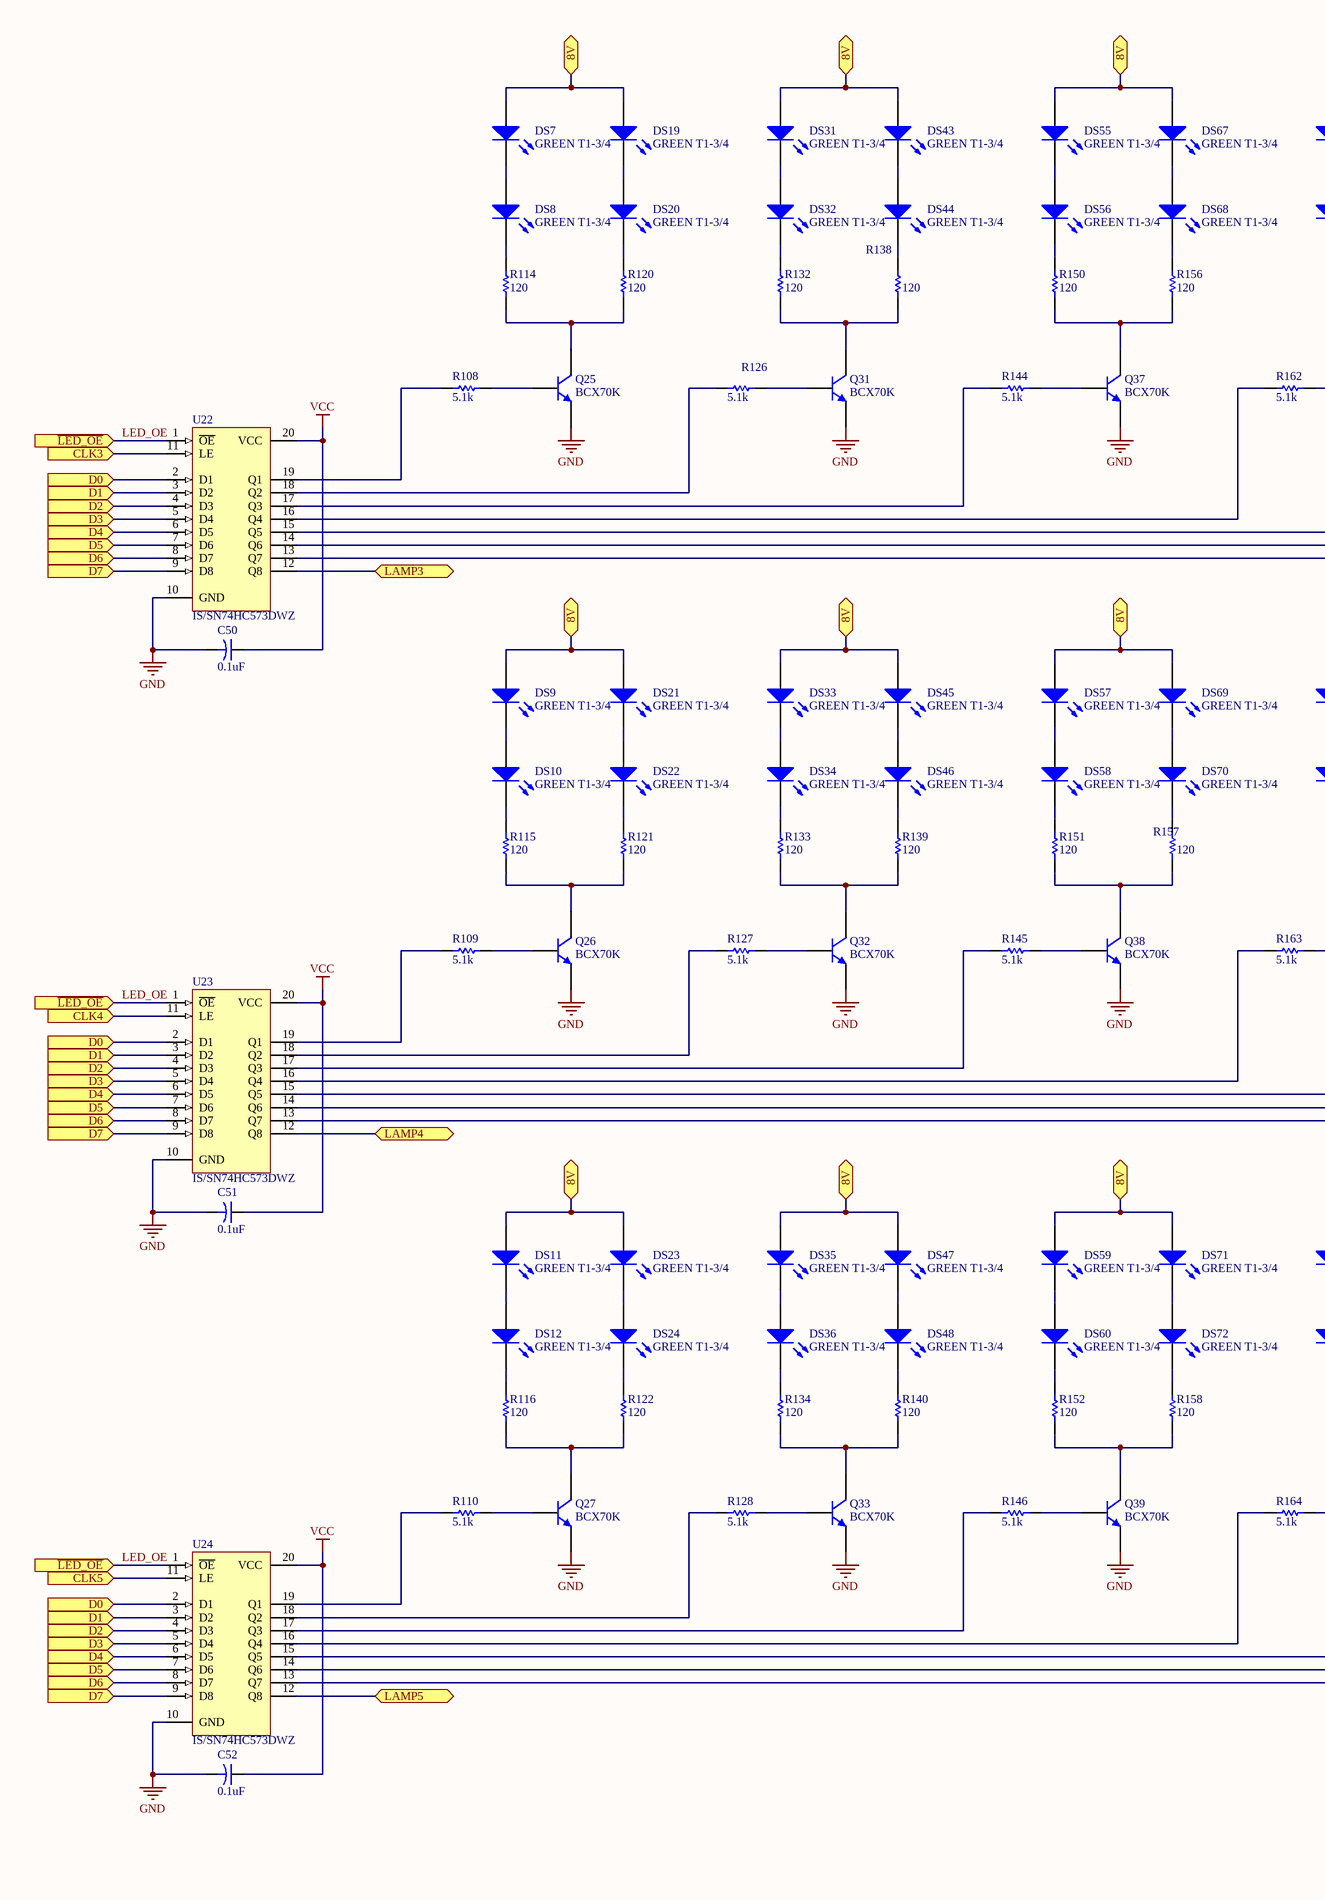
[diagram p4: ELC102 - Green Digits.SchDoc, left]
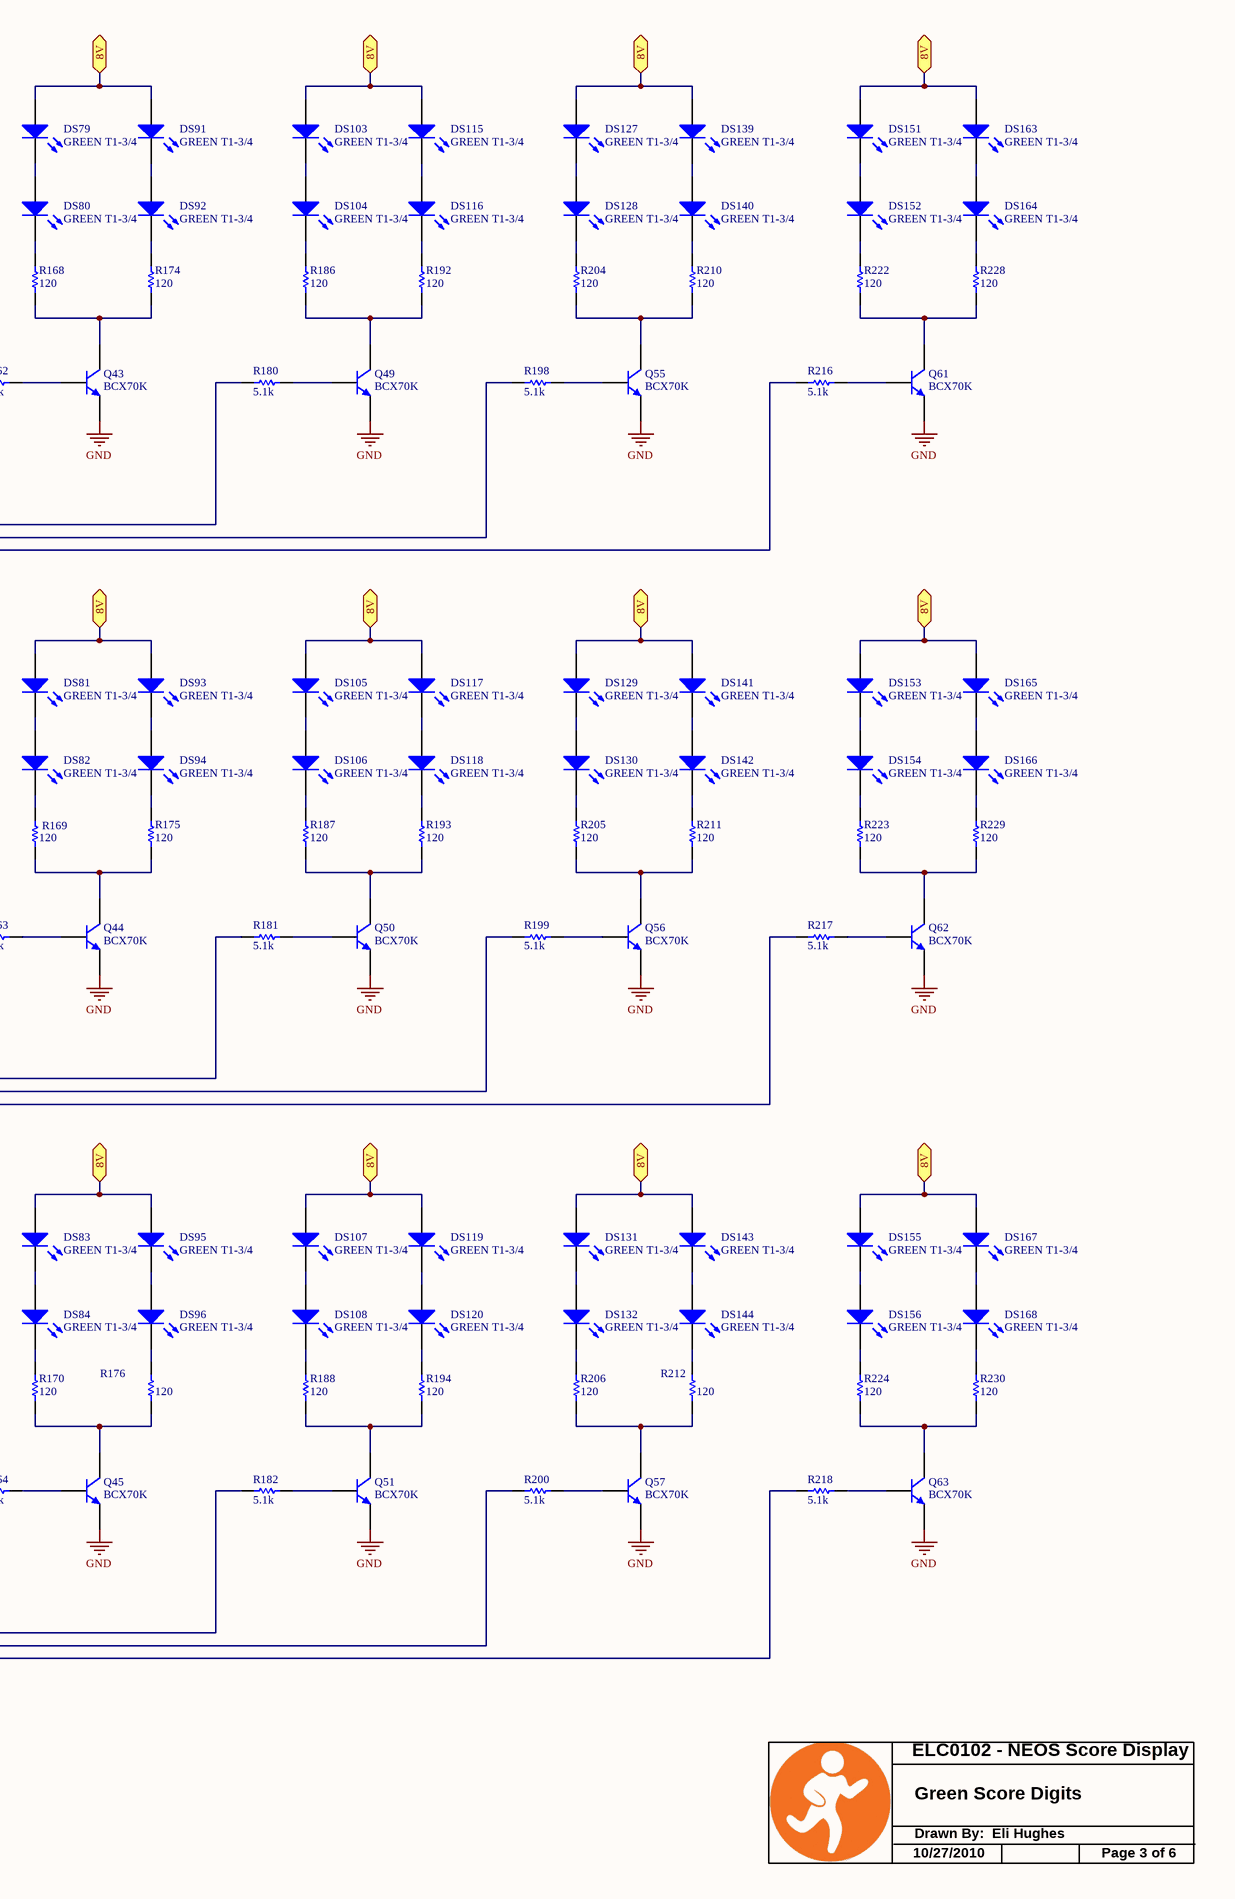
[diagram p5: ELC102 - Green Digits.SchDoc, right]

### Parts
C50  0.1uF  [C0805]
C51  0.1uF  [C0805]
C52  0.1uF  [C0805]
DS7  GREEN T1-3/4  [LED T1-3/4 Flush]
DS8  GREEN T1-3/4  [LED T1-3/4 Flush]
DS9  GREEN T1-3/4  [LED T1-3/4 Flush]
DS10  GREEN T1-3/4  [LED T1-3/4 Flush]
DS11  GREEN T1-3/4  [LED T1-3/4 Flush]
DS12  GREEN T1-3/4  [LED T1-3/4 Flush]
DS19  GREEN T1-3/4  [LED T1-3/4 Flush]
DS20  GREEN T1-3/4  [LED T1-3/4 Flush]
DS21  GREEN T1-3/4  [LED T1-3/4 Flush]
DS22  GREEN T1-3/4  [LED T1-3/4 Flush]
DS23  GREEN T1-3/4  [LED T1-3/4 Flush]
DS24  GREEN T1-3/4  [LED T1-3/4 Flush]
DS31  GREEN T1-3/4  [LED T1-3/4 Flush]
DS32  GREEN T1-3/4  [LED T1-3/4 Flush]
DS33  GREEN T1-3/4  [LED T1-3/4 Flush]
DS34  GREEN T1-3/4  [LED T1-3/4 Flush]
DS35  GREEN T1-3/4  [LED T1-3/4 Flush]
DS36  GREEN T1-3/4  [LED T1-3/4 Flush]
DS43  GREEN T1-3/4  [LED T1-3/4 Flush]
DS44  GREEN T1-3/4  [LED T1-3/4 Flush]
DS45  GREEN T1-3/4  [LED T1-3/4 Flush]
DS46  GREEN T1-3/4  [LED T1-3/4 Flush]
DS47  GREEN T1-3/4  [LED T1-3/4 Flush]
DS48  GREEN T1-3/4  [LED T1-3/4 Flush]
DS55  GREEN T1-3/4  [LED T1-3/4 Flush]
DS56  GREEN T1-3/4  [LED T1-3/4 Flush]
DS57  GREEN T1-3/4  [LED T1-3/4 Flush]
DS58  GREEN T1-3/4  [LED T1-3/4 Flush]
DS59  GREEN T1-3/4  [LED T1-3/4 Flush]
DS60  GREEN T1-3/4  [LED T1-3/4 Flush]
DS67  GREEN T1-3/4  [LED T1-3/4 Flush]
DS68  GREEN T1-3/4  [LED T1-3/4 Flush]
DS69  GREEN T1-3/4  [LED T1-3/4 Flush]
DS70  GREEN T1-3/4  [LED T1-3/4 Flush]
DS71  GREEN T1-3/4  [LED T1-3/4 Flush]
DS72  GREEN T1-3/4  [LED T1-3/4 Flush]
DS79  GREEN T1-3/4  [LED T1-3/4 Flush]
DS80  GREEN T1-3/4  [LED T1-3/4 Flush]
DS81  GREEN T1-3/4  [LED T1-3/4 Flush]
DS82  GREEN T1-3/4  [LED T1-3/4 Flush]
DS83  GREEN T1-3/4  [LED T1-3/4 Flush]
DS84  GREEN T1-3/4  [LED T1-3/4 Flush]
DS91  GREEN T1-3/4  [LED T1-3/4 Flush]
DS92  GREEN T1-3/4  [LED T1-3/4 Flush]
DS93  GREEN T1-3/4  [LED T1-3/4 Flush]
DS94  GREEN T1-3/4  [LED T1-3/4 Flush]
DS95  GREEN T1-3/4  [LED T1-3/4 Flush]
DS96  GREEN T1-3/4  [LED T1-3/4 Flush]
DS103  GREEN T1-3/4  [LED T1-3/4 Flush]
DS104  GREEN T1-3/4  [LED T1-3/4 Flush]
DS105  GREEN T1-3/4  [LED T1-3/4 Flush]
DS106  GREEN T1-3/4  [LED T1-3/4 Flush]
DS107  GREEN T1-3/4  [LED T1-3/4 Flush]
DS108  GREEN T1-3/4  [LED T1-3/4 Flush]
DS115  GREEN T1-3/4  [LED T1-3/4 Flush]
DS116  GREEN T1-3/4  [LED T1-3/4 Flush]
DS117  GREEN T1-3/4  [LED T1-3/4 Flush]
DS118  GREEN T1-3/4  [LED T1-3/4 Flush]
DS119  GREEN T1-3/4  [LED T1-3/4 Flush]
DS120  GREEN T1-3/4  [LED T1-3/4 Flush]
DS127  GREEN T1-3/4  [LED T1-3/4 Flush]
DS128  GREEN T1-3/4  [LED T1-3/4 Flush]
DS129  GREEN T1-3/4  [LED T1-3/4 Flush]
DS130  GREEN T1-3/4  [LED T1-3/4 Flush]
DS131  GREEN T1-3/4  [LED T1-3/4 Flush]
DS132  GREEN T1-3/4  [LED T1-3/4 Flush]
DS139  GREEN T1-3/4  [LED T1-3/4 Flush]
DS140  GREEN T1-3/4  [LED T1-3/4 Flush]
DS141  GREEN T1-3/4  [LED T1-3/4 Flush]
DS142  GREEN T1-3/4  [LED T1-3/4 Flush]
DS143  GREEN T1-3/4  [LED T1-3/4 Flush]
DS144  GREEN T1-3/4  [LED T1-3/4 Flush]
DS151  GREEN T1-3/4  [LED T1-3/4 Flush]
DS152  GREEN T1-3/4  [LED T1-3/4 Flush]
DS153  GREEN T1-3/4  [LED T1-3/4 Flush]
DS154  GREEN T1-3/4  [LED T1-3/4 Flush]
DS155  GREEN T1-3/4  [LED T1-3/4 Flush]
DS156  GREEN T1-3/4  [LED T1-3/4 Flush]
DS163  GREEN T1-3/4  [LED T1-3/4 Flush]
DS164  GREEN T1-3/4  [LED T1-3/4 Flush]
DS165  GREEN T1-3/4  [LED T1-3/4 Flush]
DS166  GREEN T1-3/4  [LED T1-3/4 Flush]
DS167  GREEN T1-3/4  [LED T1-3/4 Flush]
DS168  GREEN T1-3/4  [LED T1-3/4 Flush]
Q25  BCX70K  [SOT23]
Q26  BCX70K  [SOT23]
Q27  BCX70K  [SOT23]
Q31  BCX70K  [SOT23]
Q32  BCX70K  [SOT23]
Q33  BCX70K  [SOT23]
Q37  BCX70K  [SOT23]
Q38  BCX70K  [SOT23]
Q39  BCX70K  [SOT23]
Q43  BCX70K  [SOT23]
Q44  BCX70K  [SOT23]
Q45  BCX70K  [SOT23]
Q49  BCX70K  [SOT23]
Q50  BCX70K  [SOT23]
Q51  BCX70K  [SOT23]
Q55  BCX70K  [SOT23]
Q56  BCX70K  [SOT23]
Q57  BCX70K  [SOT23]
Q61  BCX70K  [SOT23]
Q62  BCX70K  [SOT23]
Q63  BCX70K  [SOT23]
R108  5.1k  [R0805]
R109  5.1k  [R0805]
R110  5.1k  [R0805]
R114  120  [R1206]
R115  120  [R1206]
R116  120  [R1206]
R120  120  [R1206]
R121  120  [R1206]
R122  120  [R1206]
R126  5.1k  [R0805]
R127  5.1k  [R0805]
R128  5.1k  [R0805]
R132  120  [R1206]
R133  120  [R1206]
R134  120  [R1206]
R138  120  [R1206]
R139  120  [R1206]
R140  120  [R1206]
R144  5.1k  [R0805]
R145  5.1k  [R0805]
R146  5.1k  [R0805]
R150  120  [R1206]
R151  120  [R1206]
R152  120  [R1206]
R156  120  [R1206]
R157  120  [R1206]
R158  120  [R1206]
R162  5.1k  [R0805]
R163  5.1k  [R0805]
R164  5.1k  [R0805]
R168  120  [R1206]
R169  120  [R1206]
R170  120  [R1206]
R174  120  [R1206]
R175  120  [R1206]
R176  120  [R1206]
R180  5.1k  [R0805]
R181  5.1k  [R0805]
R182  5.1k  [R0805]
R186  120  [R1206]
R187  120  [R1206]
R188  120  [R1206]
R192  120  [R1206]
R193  120  [R1206]
R194  120  [R1206]
R198  5.1k  [R0805]
R199  5.1k  [R0805]
R200  5.1k  [R0805]
R204  120  [R1206]
R205  120  [R1206]
R206  120  [R1206]
R210  120  [R1206]
R211  120  [R1206]
R212  120  [R1206]
R216  5.1k  [R0805]
R217  5.1k  [R0805]
R218  5.1k  [R0805]
R222  120  [R1206]
R223  120  [R1206]
R224  120  [R1206]
R228  120  [R1206]
R229  120  [R1206]
R230  120  [R1206]
U22  IS/SN74HC573DWZ  [SOIC300-20]
U23  IS/SN74HC573DWZ  [SOIC300-20]
U24  IS/SN74HC573DWZ  [SOIC300-20]

### Ports
8V, CLK3 (in), CLK4 (in), CLK5 (in), D0 (in), D1 (in), D2 (in), D3 (in), D4 (in), D5 (in), D6 (in), D7 (in), LAMP3, LAMP4, LAMP5, ~{LED_OE} (in)

### Nets
GND: C50.2 C51.2 C52.2 Q25.2(E) Q26.2(E) Q27.2(E) Q31.2(E) Q32.2(E) Q33.2(E) Q37.2(E) Q38.2(E) Q39.2(E) Q43.2(E) Q44.2(E) Q45.2(E) Q49.2(E) Q50.2(E) Q51.2(E) Q55.2(E) Q56.2(E) Q57.2(E) Q61.2(E) Q62.2(E) Q63.2(E) U22.10(GND) U23.10(GND) U24.10(GND)
VCC: C50.1 C51.1 C52.1 U22.20(VCC) U23.20(VCC) U24.20(VCC)  [project net +3.3 VDC]
8V: DS7.1(A) DS9.1(A) DS11.1(A) DS19.1(A) DS21.1(A) DS23.1(A) DS31.1(A) DS33.1(A) DS35.1(A) DS43.1(A) DS45.1(A) DS47.1(A) DS55.1(A) DS57.1(A) DS59.1(A) DS67.1(A) DS69.1(A) DS71.1(A) DS79.1(A) DS81.1(A) DS83.1(A) DS91.1(A) DS93.1(A) DS95.1(A) DS103.1(A) DS105.1(A) DS107.1(A) DS115.1(A) DS117.1(A) DS119.1(A) DS127.1(A) DS129.1(A) DS131.1(A) DS139.1(A) DS141.1(A) DS143.1(A) DS151.1(A) DS153.1(A) DS155.1(A) DS163.1(A) DS165.1(A) DS167.1(A) ; port 8V
CLK3: U22.11(LE) ; port CLK3
CLK4: U23.11(LE) ; port CLK4
CLK5: U24.11(LE) ; port CLK5
D0: U22.2(D1) U23.2(D1) U24.2(D1) ; port D0
D1: U22.3(D2) U23.3(D2) U24.3(D2) ; port D1
D2: U22.4(D3) U23.4(D3) U24.4(D3) ; port D2
D3: U22.5(D4) U23.5(D4) U24.5(D4) ; port D3
D4: U22.6(D5) U23.6(D5) U24.6(D5) ; port D4
D5: U22.7(D6) U23.7(D6) U24.7(D6) ; port D5
D6: U22.8(D7) U23.8(D7) U24.8(D7) ; port D6
D7: U22.9(D8) U23.9(D8) U24.9(D8) ; port D7
LAMP3: U22.12(Q8) ; port LAMP3
LAMP4: U23.12(Q8) ; port LAMP4
LAMP5: U24.12(Q8) ; port LAMP5
LED_OE: U22.1(~{OE}) U23.1(~{OE}) U24.1(~{OE}) ; port ~{LED_OE}
NetDS7_2: DS7.2(K) DS8.1(A)
NetDS8_2: DS8.2(K) R114.2
NetDS9_2: DS9.2(K) DS10.1(A)
NetDS10_2: DS10.2(K) R115.2
NetDS11_2: DS11.2(K) DS12.1(A)
NetDS12_2: DS12.2(K) R116.2
NetDS19_2: DS19.2(K) DS20.1(A)
NetDS20_2: DS20.2(K) R120.2
NetDS21_2: DS21.2(K) DS22.1(A)
NetDS22_2: DS22.2(K) R121.2
NetDS23_2: DS23.2(K) DS24.1(A)
NetDS24_2: DS24.2(K) R122.2
NetDS31_2: DS31.2(K) DS32.1(A)
NetDS32_2: DS32.2(K) R132.2
NetDS33_2: DS33.2(K) DS34.1(A)
NetDS34_2: DS34.2(K) R133.2
NetDS35_2: DS35.2(K) DS36.1(A)
NetDS36_2: DS36.2(K) R134.2
NetDS43_2: DS43.2(K) DS44.1(A)
NetDS44_2: DS44.2(K) R138.2
NetDS45_2: DS45.2(K) DS46.1(A)
NetDS46_2: DS46.2(K) R139.2
NetDS47_2: DS47.2(K) DS48.1(A)
NetDS48_2: DS48.2(K) R140.2
NetDS55_2: DS55.2(K) DS56.1(A)
NetDS56_2: DS56.2(K) R150.2
NetDS57_2: DS57.2(K) DS58.1(A)
NetDS58_2: DS58.2(K) R151.2
NetDS59_2: DS59.2(K) DS60.1(A)
NetDS60_2: DS60.2(K) R152.2
NetDS67_2: DS67.2(K) DS68.1(A)
NetDS68_2: DS68.2(K) R156.2
NetDS69_2: DS69.2(K) DS70.1(A)
NetDS70_2: DS70.2(K) R157.2
NetDS71_2: DS71.2(K) DS72.1(A)
NetDS72_2: DS72.2(K) R158.2
NetDS79_2: DS79.2(K) DS80.1(A)
NetDS80_2: DS80.2(K) R168.2
NetDS81_2: DS81.2(K) DS82.1(A)
NetDS82_2: DS82.2(K) R169.2
NetDS83_2: DS83.2(K) DS84.1(A)
NetDS84_2: DS84.2(K) R170.2
NetDS91_2: DS91.2(K) DS92.1(A)
NetDS92_2: DS92.2(K) R174.2
NetDS93_2: DS93.2(K) DS94.1(A)
NetDS94_2: DS94.2(K) R175.2
NetDS95_2: DS95.2(K) DS96.1(A)
NetDS96_2: DS96.2(K) R176.2
NetDS103_2: DS103.2(K) DS104.1(A)
NetDS104_2: DS104.2(K) R186.2
NetDS105_2: DS105.2(K) DS106.1(A)
NetDS106_2: DS106.2(K) R187.2
NetDS107_2: DS107.2(K) DS108.1(A)
NetDS108_2: DS108.2(K) R188.2
NetDS115_2: DS115.2(K) DS116.1(A)
NetDS116_2: DS116.2(K) R192.2
NetDS117_2: DS117.2(K) DS118.1(A)
NetDS118_2: DS118.2(K) R193.2
NetDS119_2: DS119.2(K) DS120.1(A)
NetDS120_2: DS120.2(K) R194.2
NetDS127_2: DS127.2(K) DS128.1(A)
NetDS128_2: DS128.2(K) R204.2
NetDS129_2: DS129.2(K) DS130.1(A)
NetDS130_2: DS130.2(K) R205.2
NetDS131_2: DS131.2(K) DS132.1(A)
NetDS132_2: DS132.2(K) R206.2
NetDS139_2: DS139.2(K) DS140.1(A)
NetDS140_2: DS140.2(K) R210.2
NetDS141_2: DS141.2(K) DS142.1(A)
NetDS142_2: DS142.2(K) R211.2
NetDS143_2: DS143.2(K) DS144.1(A)
NetDS144_2: DS144.2(K) R212.2
NetDS151_2: DS151.2(K) DS152.1(A)
NetDS152_2: DS152.2(K) R222.2
NetDS153_2: DS153.2(K) DS154.1(A)
NetDS154_2: DS154.2(K) R223.2
NetDS155_2: DS155.2(K) DS156.1(A)
NetDS156_2: DS156.2(K) R224.2
NetDS163_2: DS163.2(K) DS164.1(A)
NetDS164_2: DS164.2(K) R228.2
NetDS165_2: DS165.2(K) DS166.1(A)
NetDS166_2: DS166.2(K) R229.2
NetDS167_2: DS167.2(K) DS168.1(A)
NetDS168_2: DS168.2(K) R230.2
NetQ25_1: Q25.1(B) R108.2
NetQ25_3: Q25.3(C) R114.1 R120.1
NetQ26_1: Q26.1(B) R109.2
NetQ26_3: Q26.3(C) R115.1 R121.1
NetQ27_1: Q27.1(B) R110.2
NetQ27_3: Q27.3(C) R116.1 R122.1
NetQ31_1: Q31.1(B) R126.2
NetQ31_3: Q31.3(C) R132.1 R138.1
NetQ32_1: Q32.1(B) R127.2
NetQ32_3: Q32.3(C) R133.1 R139.1
NetQ33_1: Q33.1(B) R128.2
NetQ33_3: Q33.3(C) R134.1 R140.1
NetQ37_1: Q37.1(B) R144.2
NetQ37_3: Q37.3(C) R150.1 R156.1
NetQ38_1: Q38.1(B) R145.2
NetQ38_3: Q38.3(C) R151.1 R157.1
NetQ39_1: Q39.1(B) R146.2
NetQ39_3: Q39.3(C) R152.1 R158.1
NetQ43_1: Q43.1(B) R162.2
NetQ43_3: Q43.3(C) R168.1 R174.1
NetQ44_1: Q44.1(B) R163.2
NetQ44_3: Q44.3(C) R169.1 R175.1
NetQ45_1: Q45.1(B) R164.2
NetQ45_3: Q45.3(C) R170.1 R176.1
NetQ49_1: Q49.1(B) R180.2
NetQ49_3: Q49.3(C) R186.1 R192.1
NetQ50_1: Q50.1(B) R181.2
NetQ50_3: Q50.3(C) R187.1 R193.1
NetQ51_1: Q51.1(B) R182.2
NetQ51_3: Q51.3(C) R188.1 R194.1
NetQ55_1: Q55.1(B) R198.2
NetQ55_3: Q55.3(C) R204.1 R210.1
NetQ56_1: Q56.1(B) R199.2
NetQ56_3: Q56.3(C) R205.1 R211.1
NetQ57_1: Q57.1(B) R200.2
NetQ57_3: Q57.3(C) R206.1 R212.1
NetQ61_1: Q61.1(B) R216.2
NetQ61_3: Q61.3(C) R222.1 R228.1
NetQ62_1: Q62.1(B) R217.2
NetQ62_3: Q62.3(C) R223.1 R229.1
NetQ63_1: Q63.1(B) R218.2
NetQ63_3: Q63.3(C) R224.1 R230.1
NetR108_1: R108.1 U22.19(Q1)
NetR109_1: R109.1 U23.19(Q1)
NetR110_1: R110.1 U24.19(Q1)
NetR126_1: R126.1 U22.18(Q2)
NetR127_1: R127.1 U23.18(Q2)
NetR128_1: R128.1 U24.18(Q2)
NetR144_1: R144.1 U22.17(Q3)
NetR145_1: R145.1 U23.17(Q3)
NetR146_1: R146.1 U24.17(Q3)
NetR162_1: R162.1 U22.16(Q4)
NetR163_1: R163.1 U23.16(Q4)
NetR164_1: R164.1 U24.16(Q4)
NetR180_1: R180.1 U22.15(Q5)
NetR181_1: R181.1 U23.15(Q5)
NetR182_1: R182.1 U24.15(Q5)
NetR198_1: R198.1 U22.14(Q6)
NetR199_1: R199.1 U23.14(Q6)
NetR200_1: R200.1 U24.14(Q6)
NetR216_1: R216.1 U22.13(Q7)
NetR217_1: R217.1 U23.13(Q7)
NetR218_1: R218.1 U24.13(Q7)

### Notes on the sheet
- ELC0102 - NEOS Score Display
- Green Score Digits
- 10/27/2010
- Drawn By:  Eli Hughes
- Page 3 of 6

### Library data of the parts
C50-C52 = CS/C0805C104K5RACK: as C5 on sheet ELC102 - Old Circuits; ROHS Certificate: Lead free / RoHS compliant; Source: Digikey; Value: 0.1uF; Supplier 1: Digi-Key; RoHS: RoHS Compliant; Category: Capacitors; Stock 1: 10120790; Pricing 1: 10=0.105, 100=0.0378, 250=0.02732, 500=0.02016, 1000=0.01365 (USD); Voltage - Rated: 50V; Temperature Coefficient: X7R; Mounting Type: Surface Mount, MLCC; Operating Temperature: -55°C ~ 125°C; Features: -; Applications: General Purpose; Ratings: -; Package / Case: 0805 (2012 Metric); Size / Dimension: 0.079" L x 0.049" W (2.00mm x 1.25mm); Lead Spacing: -; Thickness: 0.90mm; Packaging: Cut Tape (CT); Lead Style: -; ComponentLink1URL: http://www.kemet.com/datasheets&C0805C104K5RACTU; ComponentLink1Description: http://www.kemet.com/datasheets&C0805C104K5RACTU; Supplier Part Number 1: 399-1170-1-ND
DS7-DS12 DS19-DS24 DS31-DS36 DS43-DS48 DS55-DS60 DS67-DS72 DS79-DS84 DS91-DS96 DS103-DS108 DS115-DS120 DS127-DS132 DS139-DS144 DS151-DS156 DS163-DS168 = LGCOVLFG3C7Z: Optek LED Green/Clear High Brightness T1-3/4; Source Part Number: 365-1181-ND; Description: LED 525NM ROUND GREEN 5MM; Current - Test: 20mA; Wavelength - Dominant: 525nm; Wavelength - Peak: 521nm; Millicandela Rating: 5200mcd; Voltage - Forward (Vf) Typ: 3.4V; Lens Type: Clear; Lens Style/Size: Round, 5mm, T-1 3/4; Viewing Angle: 30°; Manufacturer: OPTEK; Manufacturer Part Number: OVLFG3C7; ROHS Certificate: Lead free / RoHS compliant; Source: Digikey; Value: OVLFG3C7; Supplier 1: Digi-Key; RoHS: RoHS Compliant; Category: Optoelectronics; Stock 1: 2662; Pricing 1: 1=0.58, 100=0.3, 500=0.29, 2500=0.28, 25000=0.27 (USD); Color: Green; Luminous Flux @ Current - Test: -; Package / Case: Radial - 2 Lead; Mounting Type: Through Hole; Packaging: Bulk; ComponentLink1URL: http://media.digikey.com/pdf/Data%20Sheets/Optek%20PDFs/OVLFB3C7.pdf; ComponentLink1Description: http://media.digikey.com/pdf/Data%20Sheets/Optek%20PDFs/OVLFB3C7.pdf; Supplier Part Number 1: 365-1181-ND
Q25-Q27 Q31-Q33 Q37-Q39 Q43-Q45 Q49-Q51 Q55-Q57 Q61-Q63 = QS/BCX70K00Z: NPN SOT23 Silicon Planar Small Signal Transistor; Manufacturer: Fairchild Semiconductor; Source Part Number: BCX70K-ND; Description: TRANS NPN AF 45V SOT-23; Current - Collector (Ic) (Max): 100mA; Voltage - Collector Emitter Breakdown (Max): 45V; Vce Saturation (Max) @ Ib, Ic: 550mV @ 1.25mA, 50mA; DC Current Gain (hFE) (Min) @ Ic, Vce: 380 @ 2mA, 5V; Power - Max: 330mW; Frequency - Transition: 250MHz; Manufacturer Part Number: BCX70K; ROHS Certificate: Lead free / RoHS compliant; Source: Digikey; Value: BCX70K; Supplier 1: Digi-Key; RoHS: RoHS Compliant; Category: Discrete Semiconductor Products; Stock 1: 69796; Pricing 1: 1=0.5, 10=0.331, 100=0.144, 500=0.06624, 1000=0.0468 (USD); Transistor Type: NPN; Current - Collector Cutoff (Max): -; Mounting Type: Surface Mount; Package / Case: SOT-23-3, TO-236-3, Micro3™, SSD3, SST3; Packaging: Cut Tape (CT); Supplier Device Package: SOT-23; ComponentLink1URL: http://www.infineon.com/dgdl/bcw60_bcx70.pdf?folderId=db3a304412b407950112b43286c05890&fileId=db3a304412b407950112b43287355891; ComponentLink1Description: http://www.infineon.com/dgdl/bcw60_bcx70.pdf?folderId=db3a304412b407950112b43286c05890&fileId=db3a304412b407950112b43287355891; Supplier Part Number 1: BCX70KINCT-ND
R108-R110 R126-R128 R144-R146 R162-R164 R180-R182 R198-R200 R216-R218 = ERJ-6ENF5101V: as JP1 on sheet ELC102 - Old Circuits; ComponentLink1Description: http://industrial.panasonic.com/www-cgi/jvcr13pz.cgi?E+PZ+3+AOA0002+ERJ6ENF5101V+7+WW; ComponentLink1URL: http://industrial.panasonic.com/www-cgi/jvcr13pz.cgi?E+PZ+3+AOA0002+ERJ6ENF5101V+7+WW; Value: 5.1k; Supplier 1: Digi-Key; Manufacturer Part Number: ERJ-6ENF5101V; RoHS: RoHS Compliant; Category: Resistors; Stock 1: 32293; Pricing 1: 1=0.07, 50=0.0276, 100=0.021, 250=0.0156, 500=0.01152, 1000=0.00768 (USD); Resistance In Ohms: 5.10K; Composition: Thick Film; Features: -; Tolerance: ±1%; Case: 0805 (2012 metric); Size / Dimension: 0.079" L x 0.049" W (2.00mm x 1.25mm); Height: 0.024" (0.60mm); Lead Style: Surface Mount (SMD - SMT); Packaging: Digi-Reel®; Supplier Part Number 1: P5.10KCDKR-ND
R114-R116 R120-R122 R132-R134 R138-R140 R150-R152 R156-R158 R168-R170 R174-R176 R186-R188 R192-R194 R204-R206 R210-R212 R222-R224 R228-R230 = ERJ-8ENF1200V: RES 120 OHM 1/4W 1% 1206 SMD; Manufacturer: Panasonic - ECG; Power (Watts): 0.25W, 1/4W; Temperature Coefficient: ±100ppm/°C; Value: 120; Supplier 1: Digi-Key; Manufacturer Part Number: ERJ-8ENF1200V; RoHS: RoHS Compliant; Category: Resistors; Stock 1: 58342; Pricing 1: 1=0.1, 50=0.0368, 100=0.028, 250=0.0208, 500=0.01536, 1000=0.01024 (USD); Resistance In Ohms: 120; Composition: Thick Film; Features: -; Tolerance: ±1%; Case: 1206 (3216 metric); Size / Dimension: 0.126" L x 0.063" W (3.20mm x 1.60mm); Height: 0.024" (0.60mm); Lead Style: Surface Mount (SMD - SMT); Packaging: Cut Tape (CT); ComponentLink1URL: http://industrial.panasonic.com/www-cgi/jvcr13pz.cgi?E+PZ+3+AOA0002+ERJ8ENF1200V+7+WW; ComponentLink1Description: http://industrial.panasonic.com/www-cgi/jvcr13pz.cgi?E+PZ+3+AOA0002+ERJ8ENF1200V+7+WW; Supplier Part Number 1: P120FCT-ND
U22-U24 = IS/SN74HC573DWZ: Octal D-Type Transparent Latch with 3-State Outputs; Manufacturer: NXP Semiconductors; Manufacturer Part Number: 74HC573D-T; Source Part Number: 568-1477-2-ND; Value: 74HC573D-T; Description: IC LATCH OCTAL D 3STATE 20SOIC; Circuit: 8:8; Output Type: Tri-State; Voltage - Supply: 2 V ~ 6 V; Independent Circuits: 1; Delay Time - Propagation: 14ns; Current - Output High, Low: 7.8mA, 7.8mA; ROHS Certificate: Lead free / RoHS compliant; Source: Digikey; Supplier 1: Digi-Key; RoHS: RoHS Compliant; Category: Integrated Circuits (ICs); Stock 1: 46803; Pricing 1: 1=0.84, 25=0.646, 100=0.57, 250=0.494, 500=0.418 (USD); Logic Type: D-Type Transparent Latch; Operating Temperature: -40°C ~ 125°C; Mounting Type: Surface Mount; Package / Case: 20-SOIC (0.300", 7.50mm Width); Packaging: Cut Tape (CT); Supplier Device Package: 20-SOIC; ComponentLink1URL: http://www.nxp.com/documents/data_sheet/74HC_HCT573.pdf; ComponentLink1Description: http://www.nxp.com/documents/data_sheet/74HC_HCT573.pdf; Supplier Part Number 1: 568-1477-1-ND